# EAGLE schematic Display (EAGLE 6.0)
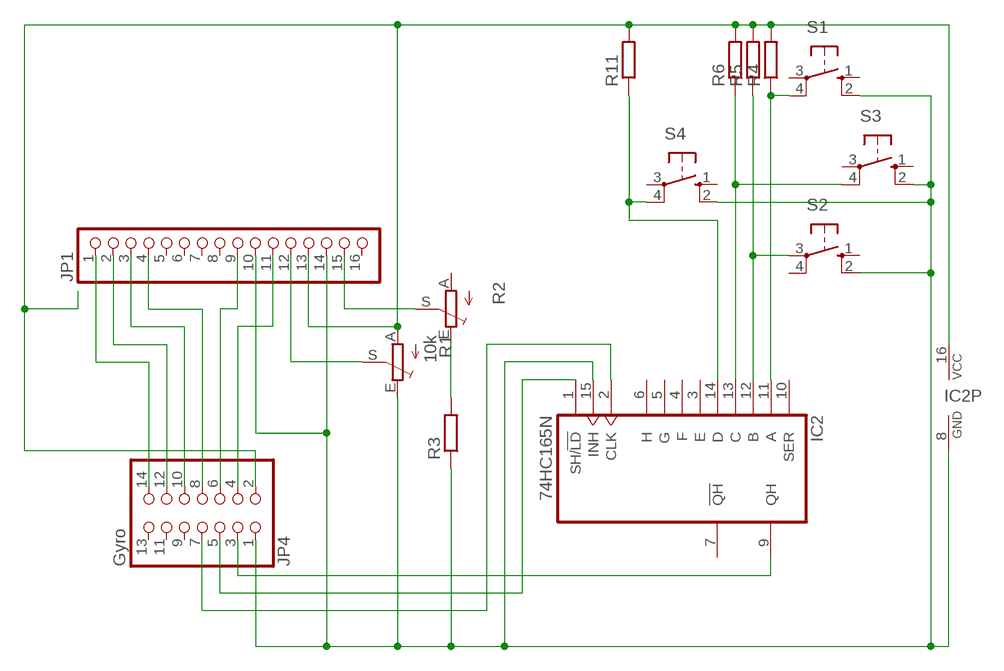
[diagram p0: schematic, sheet 1]

## Parts
IC2  74HC165N  [DIL16]
JP1  PINHD-1X16  [1X16]
JP4  Gyro  PINHD-2X7  [2X07]
R1  10k  TRIM_EU-CA9H  [CA9H]
R2  TRIM_EU-CA9H  [CA9H]
R3  R-EU_0207/10  [0207/10]
R4  R-EU_0207/10  [0207/10]
R5  R-EU_0207/10  [0207/10]
R6  R-EU_0207/10  [0207/10]
R11  R-EU_0207/10  [0207/10]
S1  10-XX  [B3F-10XX]
S2  10-XX  [B3F-10XX]
S3  10-XX  [B3F-10XX]
S4  10-XX  [B3F-10XX]

## Nets
N$1: JP1.15 R2.S
N$2: IC2.8(GND) IC2.15(INH) JP1.10 JP1.14 JP4.1 R1.E R3.1 S1.2(S1) S2.2(S1) S3.2(S1) S4.2(S1)
N$3: JP1.13 JP4.2 R1.A R4.2 R5.2 R6.2 R11.2
N$4: R2.E R3.2
N$6: JP1.11 JP4.4
N$9: IC2.1(SH/!LD) JP4.5
N$12: JP1.12 R1.S
N$13: IC2.9(QH) JP4.3
N$14: IC2.2(CLK) JP4.7
N$15: JP1.9 JP4.6
N$18: JP1.4 JP4.8
N$19: JP1.3 JP4.10
N$21: JP1.2 JP4.12
N$22: JP1.1 JP4.14
N$32: IC2.11(A) R4.1 S1.4(P1)
N$34: IC2.12(B) R5.1 S2.3(P)
N$35: IC2.13(C) R6.1 S3.4(P1)
N$36: IC2.14(D) R11.1 S4.4(P1)
Unconnected: IC2.3(E) IC2.4(F) IC2.5(G) IC2.6(H) IC2.7(!QH) IC2.10(SER) JP1.5 JP1.6 JP1.7 JP1.8 JP1.16 JP4.9 JP4.11 JP4.13 R2.A S1.1(S) S1.3(P) S2.1(S) S2.4(P1) S3.1(S) S3.3(P) S4.1(S) S4.3(P)

## Power pins joined to a net without a drawn wire
VCC: IC2.16(VCC)

## Library data of the parts
IC2 = 74xx-eu:74*165: 8-bit parallel load SHIFT REGISTER
JP1 = pinhead:PINHD-1X16: PIN HEADER
JP4 = pinhead:PINHD-2X7: PIN HEADER
R1 R2 = pot:TRIM_EU-: POTENTIOMETER
R3-R6 R11 = rcl:R-EU_: RESISTOR, European symbol
S1-S4 = switch-omron:10-XX: OMRON SWITCH; MPN: B3F-1000; OC_FARNELL: 176432; OC_NEWARK: 36M3542